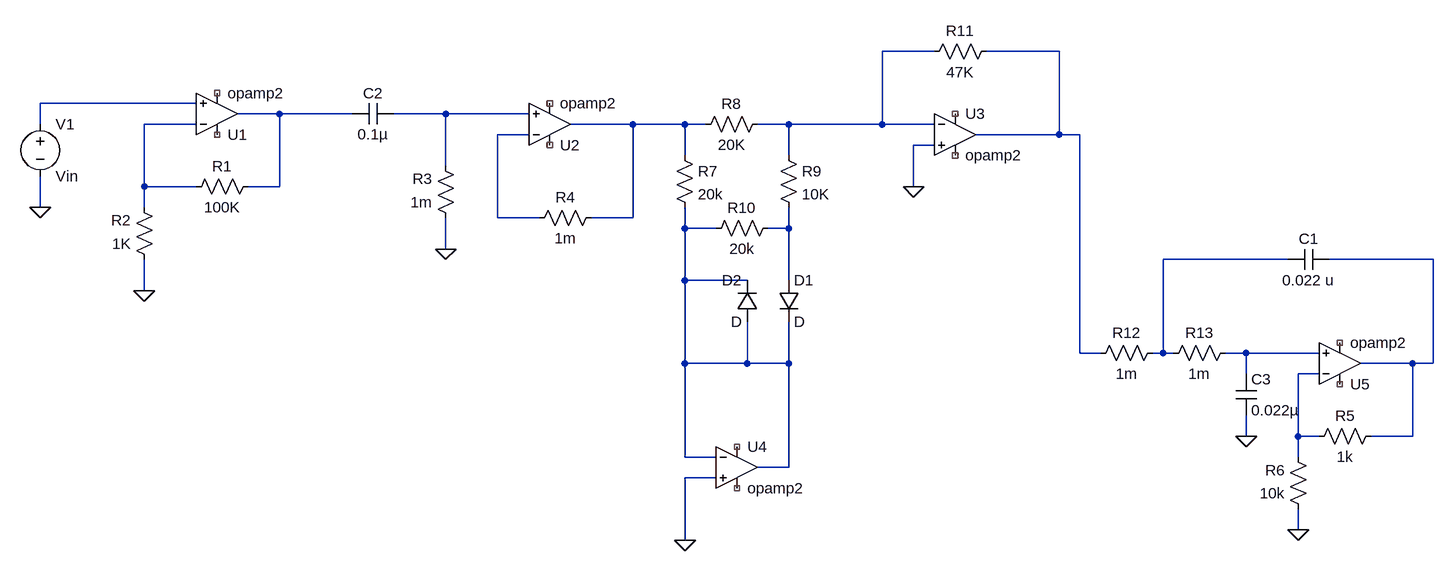
[diagram p0: schematic PrecisionRecifier.asc]
PrecisionRecifier.asc, the LTspice schematic file:
Version 4
SHEET 1 1860 900
WIRE 1088 -112 1008 -112
WIRE 1280 -112 1168 -112
WIRE -48 -32 -288 -32
WIRE 80 -16 16 -16
WIRE 192 -16 80 -16
WIRE 336 -16 256 -16
WIRE 464 -16 336 -16
WIRE -288 0 -288 -32
WIRE -48 0 -128 0
WIRE 624 0 528 0
WIRE 704 0 624 0
WIRE 736 0 704 0
WIRE 864 0 816 0
WIRE 1008 0 1008 -112
WIRE 1008 0 864 0
WIRE 1088 0 1008 0
WIRE 464 16 416 16
WIRE 1280 16 1280 -112
WIRE 1280 16 1152 16
WIRE 1312 16 1280 16
WIRE 1088 32 1056 32
WIRE 704 48 704 0
WIRE 864 48 864 0
WIRE 336 64 336 -16
WIRE -128 96 -128 0
WIRE -48 96 -128 96
WIRE 80 96 80 -16
WIRE 80 96 32 96
WIRE 1056 96 1056 32
WIRE -288 128 -288 80
WIRE -128 128 -128 96
WIRE 416 144 416 16
WIRE 480 144 416 144
WIRE 624 144 624 0
WIRE 624 144 560 144
WIRE 704 160 704 128
WIRE 752 160 704 160
WIRE 864 160 864 128
WIRE 864 160 832 160
WIRE 336 192 336 144
WIRE 1632 208 1440 208
WIRE 1856 208 1696 208
WIRE 704 240 704 160
WIRE 800 240 704 240
WIRE 864 240 864 160
WIRE -128 256 -128 208
WIRE 1312 352 1312 16
WIRE 1344 352 1312 352
WIRE 1440 352 1440 208
WIRE 1440 352 1424 352
WIRE 1456 352 1440 352
WIRE 1568 352 1536 352
WIRE 1680 352 1568 352
WIRE 704 368 704 240
WIRE 800 368 800 304
WIRE 800 368 704 368
WIRE 864 368 864 304
WIRE 864 368 800 368
WIRE 1824 368 1744 368
WIRE 1856 368 1856 208
WIRE 1856 368 1824 368
WIRE 1568 384 1568 352
WIRE 1680 384 1648 384
WIRE 1568 480 1568 448
WIRE 1648 480 1648 384
WIRE 1680 480 1648 480
WIRE 1824 480 1824 368
WIRE 1824 480 1760 480
WIRE 704 512 704 368
WIRE 752 512 704 512
WIRE 1648 512 1648 480
WIRE 864 528 864 368
WIRE 864 528 816 528
WIRE 752 544 704 544
WIRE 1648 624 1648 592
WIRE 704 640 704 544
FLAG 336 192 0
FLAG 1056 96 0
FLAG 1568 480 0
FLAG 1648 624 0
FLAG -288 128 0
FLAG -128 256 0
FLAG 704 640 0
SYMBOL Opamps\\opamp2 -16 48 M180
SYMATTR InstName U1
SYMBOL Opamps\\opamp2 496 64 M180
SYMATTR InstName U2
SYMBOL Opamps\\opamp2 1120 -48 R0
SYMATTR InstName U3
SYMBOL Opamps\\opamp2 784 464 R0
SYMATTR InstName U4
SYMBOL Opamps\\opamp2 1712 432 M180
SYMATTR InstName U5
SYMBOL res 48 80 R90
WINDOW 0 0 56 VBottom 2
WINDOW 3 32 56 VTop 2
SYMATTR InstName R1
SYMATTR Value 100K
SYMBOL res -112 224 R180
WINDOW 0 36 76 Left 2
WINDOW 3 36 40 Left 2
SYMATTR InstName R2
SYMATTR Value 1K
SYMBOL res 352 160 R180
WINDOW 0 36 76 Left 2
WINDOW 3 36 40 Left 2
SYMATTR InstName R3
SYMATTR Value 1m
SYMBOL res 464 160 R270
WINDOW 0 32 56 VTop 2
WINDOW 3 0 56 VBottom 2
SYMATTR InstName R4
SYMATTR Value 1m
SYMBOL res 1776 464 R90
WINDOW 0 0 56 VBottom 2
WINDOW 3 32 56 VTop 2
SYMATTR InstName R5
SYMATTR Value 1k
SYMBOL res 1664 608 R180
WINDOW 0 36 76 Left 2
WINDOW 3 36 40 Left 2
SYMATTR InstName R6
SYMATTR Value 10k
SYMBOL cap 1696 192 R90
WINDOW 0 0 32 VBottom 2
WINDOW 3 32 32 VTop 2
SYMATTR InstName C1
SYMATTR Value 0.022 u
SYMBOL cap 256 -32 R90
WINDOW 0 0 32 VBottom 2
WINDOW 3 32 32 VTop 2
SYMATTR InstName C2
SYMATTR Value 0.1µ
SYMBOL res 688 32 R0
SYMATTR InstName R7
SYMATTR Value 20k
SYMBOL res 832 -16 R90
WINDOW 0 0 56 VBottom 2
WINDOW 3 32 56 VTop 2
SYMATTR InstName R8
SYMATTR Value 20K
SYMBOL res 848 32 R0
SYMATTR InstName R9
SYMATTR Value 10K
SYMBOL res 848 144 R90
WINDOW 0 0 56 VBottom 2
WINDOW 3 32 56 VTop 2
SYMATTR InstName R10
SYMATTR Value 20k
SYMBOL res 1184 -128 R90
WINDOW 0 0 56 VBottom 2
WINDOW 3 32 56 VTop 2
SYMATTR InstName R11
SYMATTR Value 47K
SYMBOL diode 848 240 R0
SYMATTR InstName D1
SYMBOL diode 816 304 R180
WINDOW 0 24 64 Left 2
WINDOW 3 24 0 Left 2
SYMATTR InstName D2
SYMBOL res 1440 336 R90
WINDOW 0 0 56 VBottom 2
WINDOW 3 32 56 VTop 2
SYMATTR InstName R12
SYMATTR Value 1m
SYMBOL res 1552 336 R90
WINDOW 0 0 56 VBottom 2
WINDOW 3 32 56 VTop 2
SYMATTR InstName R13
SYMATTR Value 1m
SYMBOL cap 1552 384 R0
SYMATTR InstName C3
SYMATTR Value 0.022µ
SYMBOL voltage -288 -16 R0
WINDOW 123 0 0 Left 2
WINDOW 39 0 0 Left 2
SYMATTR InstName V1
SYMATTR Value Vin

The netlist it stands for:
* PrecisionRecifier.asc
XU1 N003 N006 NC_01 NC_02 N004 opamp2  ; pins In+ In- V+ V- OUT
XU2 N005 N008 NC_03 NC_04 N007 opamp2  ; pins In+ In- V+ V- OUT
XU3 0 N001 NC_05 NC_06 N002 opamp2  ; pins In+ In- V+ V- OUT
XU4 0 N009 NC_07 NC_08 N009 opamp2  ; pins In+ In- V+ V- OUT
XU5 N013 N014 NC_09 NC_10 N012 opamp2  ; pins In+ In- V+ V- OUT
R1 N004 N006 100K
R2 0 N006 1K
R3 0 N005 1m
R4 N008 N007 1m
R5 N012 N014 1k
R6 0 N014 10k
C1 N012 N011 0.022 u
C2 N005 N004 0.1µ
R7 N007 N009 20k
R8 N001 N007 20K
R9 N001 N010 10K
R10 N010 N009 20k
R11 N002 N001 47K
D1 N010 N009 D
D2 N009 N009 D
R12 N011 N002 1m
R13 N013 N011 1m
C3 N013 0 0.022µ
V1 N003 0 Vin
.model D D
.lib standard.dio
.backanno
.end